# Altium schematic sheet Power Isolation.SchDoc: Power Isolation
size 431 x 279 mm; Engineer: Harsha Sandirigama; Revision: -; SheetNumber: 2; SheetTotal: 3; Project: USB Isolator; ENG_APP_DATE: --/--/--; DSN_APP_DATE: --/--/--; CHK_APP_DATE: --/--/--
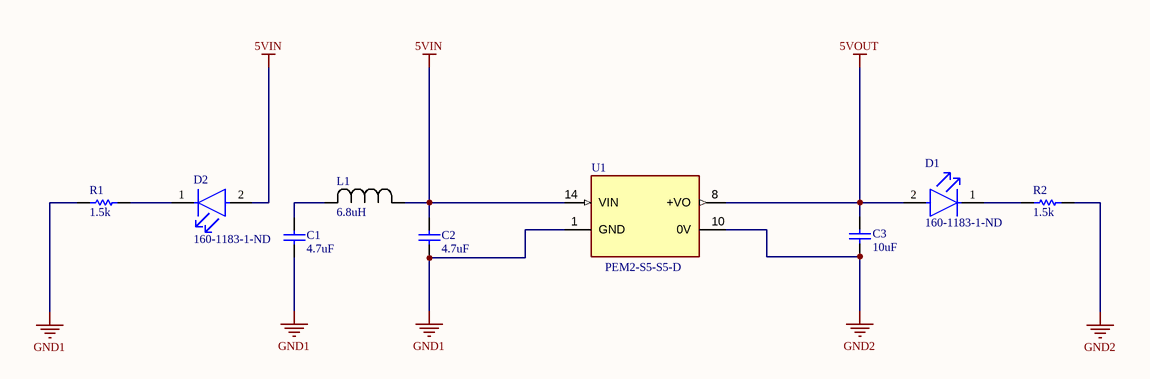
[diagram p0: Power Isolation.SchDoc]

## Parts
C1  4.7uF  [1206C]
C2  4.7uF  [1206C]
C3  10uF  [1206C]
D1  Supplier Part Number 1: 160-1183-1-ND  [Lite-On_0_MFG]  (hidden comment: LED)
D2  Supplier Part Number 1: 160-1183-1-ND  [Lite-On_0_MFG]  (hidden comment: LED)
L1  6.8uH  [IND_TAIYO_LBC3225_TAY]
R1  1.5k  [0805R]
R2  1.5k  [0805R]
U1  PEM2-S5-S5-D  [CONV_PEM2-S5-S5-D]

## Nets
5VIN: C2.2 D2.2(A) L1.1 U1.14(VIN)
5VOUT: C3.2 D1.2(A) U1.8(+VO)
GND1: C1.1 C2.1 R1.1 U1.1(GND)
GND2: C3.1 R2.2 U1.10(0V)
NetC1_2: C1.2 L1.2
NetD1_1: D1.1(C) R2.1
NetD2_1: D2.1(C) R1.2

## Notes on the sheet
- DWG. NO.
- REV.
- SHT.
- THIS DOCUMENT AND THE DATA DISCLOSED HEREIN OR HEREWITH IS THE PROPERTY OF ALTIUM LIMITED AND MAY BE FREELY DISTRIBUTED IN WHOLE. NO RIGHTS ARE RESERVED OR EXPRESS OR IMPLIED WARANTEE GIVEN.
- REVISION
- DESCRIPTION
- DATE
- APPROVED
- ENG:
- APPROVALS
- PROJECT
- DSN:
- CHK:
- REFERENCE DOCUMENTS
- PROJECT REVISION:
- TITLE
- DOCUMENT REVISION:
- DESIGN ITEM:
- BOM:
- FAB DWG:
- PCB DWG:
- ASSY DWG:
- SCALE:
- SIZE
- B
- CAGE CODE
- FILE NAME
- DWG NO.
- SHEET
- OF
- REV

## Library data of the parts
C1 C2 = GRM31CR71H475KA12L: CAP CER 4.7UF 50V X7R 1206; Manufacturer: Murata; Material: Ceramic; Tolerance: 10%; Supplier 1: Digi-Key; Manufacturer Part Number: GRM31CR71H475KA12L; RoHS: Yes; Category: Ceramic Capacitors; Stock 1: 866926; Pricing 1: 1=0.44000, 10=0.30200, 50=0.21180, 100=0.18150, 500=0.13612, 1000=0.11495 (USD); Mount: Surface Mount; Case/Package: 1206; Case Code (Metric): 3216; Case Code (Imperial): 1206; Min Operating Temperature: -55°C; Max Operating Temperature: 125°C; Capacitance: 4.7uF; Packaging: Tape and Reel; Voltage Rating (DC): 50V; Package Quantity: 2000; Voltage Rating: 50V; Dielectric: X7R; Voltage: 50V; Termination: SMD/SMT; Series: GRM; Construction: Flat; Length: 3.2mm; Width: 0.063inch; Height: 1.6mm; Depth: 1.6mm; Thickness: 0.071inch; Radiation Hardening: No; REACH SVHC: No SVHC; Lead Free: Lead Free; RoHS Compliant: Yes; ComponentLink1URL: https://datasheet.ciiva.com/6072/415379-6072784.pdf?src-supplier=Farnell; ComponentLink1Description: https://datasheet.ciiva.com/6072/415379-6072784.pdf?src-supplier=Farnell; ComponentLink2URL: https://datasheet.ciiva.com/3777/2267grm31cr71h475ka1223-3777241.pdf?src-supplier=Arrow+Electronics; ComponentLink2Description: https://datasheet.ciiva.com/3777/2267grm31cr71h475ka1223-3777241.pdf?src-supplier=Arrow+Electronics; ComponentLink3URL: https://datasheet.ciiva.com/29202/450972-da-01-de-vs-chip-kond-1206-4-7-uf-10pr-50-0v-x7r-29202576.pdf?src-supplier=Conrad; ComponentLink3Description: https://datasheet.ciiva.com/29202/450972-da-01-de-vs-chip-kond-1206-4-7-uf-10pr-50-0v-x7r-29202576.pdf?src-supplier=Conrad; ComponentLink4URL: https://datasheet.ciiva.com/29202/451279-da-01-de-vs-kondens-grm31-cr71h-475ka12l-29202365.pdf?src-supplier=Conrad; ComponentLink4Description: https://datasheet.ciiva.com/29202/451279-da-01-de-vs-kondens-grm31-cr71h-475ka12l-29202365.pdf?src-supplier=Conrad; ComponentLink5URL: https://datasheet.ciiva.com/7937/415310-7937749.pdf?src-supplier=Element14; ComponentLink5Description: https://datasheet.ciiva.com/7937/415310-7937749.pdf?src-supplier=Element14; ComponentLink6URL: https://datasheet.ciiva.com/6270/partnumbering-e-01-6270218.pdf?src-supplier=Digi-Key; ComponentLink6Description: https://datasheet.ciiva.com/6270/partnumbering-e-01-6270218.pdf?src-supplier=Digi-Key; ComponentLink7URL: https://datasheet.ciiva.com/6270/partnumbering-e-01-6270217.pdf?src-supplier=Digi-Key; ComponentLink7Description: https://datasheet.ciiva.com/6270/partnumbering-e-01-6270217.pdf?src-supplier=Digi-Key; ComponentLink8URL: https://datasheet.ciiva.com/6270/partnumbering-e-01-6270219.pdf?src-supplier=Digi-Key; ComponentLink8Description: https://datasheet.ciiva.com/6270/partnumbering-e-01-6270219.pdf?src-supplier=Digi-Key; Supplier Part Number 1: 490-6521-1-ND
C3 = TMK316BJ106ML-T: Capacitor 10uF ±20% 25V 1206; Manufacturer: Taiyo Yuden; Tolerance: 10%; Dielectric: X5R; Supplier 1: Digi-Key; Manufacturer Part Number: TMK316BJ106ML-T; RoHS: Yes; Category: Ceramic Capacitors; Stock 1: 411339; Pricing 1: 1=0.28000, 10=0.18900, 50=0.12600, 100=0.10710, 500=0.07562, 1000=0.06617 (USD); Mount: Surface Mount; Case/Package: 1206; Number of Pins: 2; Case Code (Imperial): 1206; Case Code (Metric): 3216; Contact Plating: Nickel; Min Operating Temperature: -55°C; Max Operating Temperature: 85°C; Capacitance: 10uF; Packaging: Tape and Reel; Voltage Rating: 25V; Package Quantity: 1; Voltage Rating (DC): 25V; Termination: SMD/SMT; Voltage: 25V; Series: M; Construction: Flat; Resistor Type: Ceramic; Length: 3.2mm; Width: 1.6mm; Height: 1.6mm; Depth: 1.6mm; Thickness: 0.071inch; Radiation Hardening: No; REACH SVHC: Unknown; RoHS Compliant: Yes; Lead Free: Lead Free; Halogen Free: Halogen Free; ComponentLink1URL: https://datasheet.ciiva.com/137/tmk316bj106ml-t-ss-137881.pdf?src-supplier=Digi-Key; ComponentLink1Description: https://datasheet.ciiva.com/137/tmk316bj106ml-t-ss-137881.pdf?src-supplier=Digi-Key; ComponentLink2URL: https://datasheet.ciiva.com/11601/tmk316bj106ml-t-ss-11601883.pdf?src-supplier=Avnet; ComponentLink2Description: https://datasheet.ciiva.com/11601/tmk316bj106ml-t-ss-11601883.pdf?src-supplier=Avnet; ComponentLink3URL: https://datasheet.ciiva.com/15922/1117tmk316bj106ml-t-15922416.pdf?src-supplier=Onlinecomponents.com; ComponentLink3Description: https://datasheet.ciiva.com/15922/1117tmk316bj106ml-t-15922416.pdf?src-supplier=Onlinecomponents.com; ComponentLink4URL: https://datasheet.ciiva.com/30087/617tmk316bj106ml-t-30087946.pdf?src-supplier=Onlinecomponents.com; ComponentLink4Description: https://datasheet.ciiva.com/30087/617tmk316bj106ml-t-30087946.pdf?src-supplier=Onlinecomponents.com; ComponentLink5URL: https://datasheet.ciiva.com/7975/1481447-7975845.pdf?src-supplier=Element14; ComponentLink5Description: https://datasheet.ciiva.com/7975/1481447-7975845.pdf?src-supplier=Element14; ComponentLink6URL: https://datasheet.ciiva.com/7975/1481447-7975597.pdf?src-supplier=Element14; ComponentLink6Description: https://datasheet.ciiva.com/7975/1481447-7975597.pdf?src-supplier=Element14; ComponentLink7URL: https://datasheet.ciiva.com/28645/746258-28645286.pdf?src-supplier=Element14; ComponentLink7Description: https://datasheet.ciiva.com/28645/746258-28645286.pdf?src-supplier=Element14
D1 D2 = LTST-C190GKT: LED 0603(H=0.9mm) λD=569nm VR=5V VF=2.1V~2.6V IF=20mA PD=100mW; Manufacturer: Vishay Lite-On; Color: Green; Lens Color: Colorless; Luminous Intensity: 6mcd; Forward Voltage: 2.1V; Viewing Angle: 130°; Lens Style: Clear,Diffused,Colorless,Rectangular; Forward Current: 30mA; Dominant Wavelength: 569nm; Test Current: 10mA; Number of Elements: 1; Power Dissipation: 100mW; Wavelength: 565nm; Reverse Voltage: 5V; Lens Transparency: Clear; Voltage: 2V; Supplier 1: Digi-Key; Manufacturer Part Number: LTST-C190GKT; RoHS: Yes; Category: LEDs; Stock 1: 553647; Pricing 1: 1=0.24000, 10=0.13200, 100=0.06110, 500=0.05640, 1000=0.04418, 2000=0.04324 (USD); Mount: Surface Mount; Case/Package: 0603; Number of Pins: 2; Case Code (Metric): 1608; Case Code (Imperial): 0603; Min Operating Temperature: -55°C; Max Operating Temperature: 85°C; Package Quantity: 1; Packaging: Tape and Reel; Illumination Color: Green; Number of LEDs: 1; Power Rating: 100mW; Length: 1.6mm; Width: 0.8mm; Height: 0.8mm; Depth: 0.8mm; Radiation Hardening: No; RoHS Compliant: Yes; Lead Free: Lead Free; ComponentLink1URL: https://datasheet.ciiva.com/2109/ltst-c190gkt-2109985.pdf?src-supplier=Digi-Key; ComponentLink1Description: https://datasheet.ciiva.com/2109/ltst-c190gkt-2109985.pdf?src-supplier=Digi-Key; ComponentLink2URL: https://datasheet.ciiva.com/11775/0900766b80dc02a6-11775616.pdf?src-supplier=RSComponents; ComponentLink2Description: https://datasheet.ciiva.com/11775/0900766b80dc02a6-11775616.pdf?src-supplier=RSComponents; ComponentLink3URL: https://datasheet.ciiva.com/12403/lite-on-ltst-c190gkt-187204-12403884.pdf?src-supplier=Mouser; ComponentLink3Description: https://datasheet.ciiva.com/12403/lite-on-ltst-c190gkt-187204-12403884.pdf?src-supplier=Mouser; ComponentLink4URL: https://datasheet.ciiva.com/16392/lite-on20ltst-c190gkt-16392818.pdf?src-supplier=Future+Electronics; ComponentLink4Description: https://datasheet.ciiva.com/16392/lite-on20ltst-c190gkt-16392818.pdf?src-supplier=Future+Electronics; ComponentLink5URL: https://datasheet.ciiva.com/2109/ltst-c190gkt-2109986.pdf?src-supplier=Digi-Key; ComponentLink5Description: https://datasheet.ciiva.com/2109/ltst-c190gkt-2109986.pdf?src-supplier=Digi-Key; ComponentLink6URL: https://datasheet.ciiva.com/2109/ltst-c190gkt-2109987.pdf?src-supplier=Digi-Key; ComponentLink6Description: https://datasheet.ciiva.com/2109/ltst-c190gkt-2109987.pdf?src-supplier=Digi-Key
L1 = LBC3225T6R8MR_1: Inductor General Purpose Chip Wirewound 6.8uH 20% 100KHz Ferrite 0.62A 0.156Ohm DCR 1210 T/R; Mfr_Name: Taiyo Yuden; Type: DEV; Self Resonant Frequency: 50MHz; Current Rating: 620mA; Shielding: Unshielded; DC Resistance (DCR): 120mR; Copyright: Copyright (C) 2022 Ultra Librarian. All rights reserved.; Manufacturer_Part_Number: LBC3225T6R8MR; RefDes: RefDes; Supplier 1: Digi-Key; Manufacturer: Taiyo Yuden; Manufacturer Part Number: LBC3225T6R8MR; RoHS: Yes; Category: Fixed Inductors; Stock 1: 24416; Pricing 1: 1=0.20000, 10=0.17800, 25=0.15840, 50=0.13460, 100=0.11880, 250=0.10888, 500=0.09900 (USD); Mount: Surface Mount; Case/Package: 1210; Number of Pins: 2; Core Material: Ferrite; Case Code (Metric): 3225; Case Code (Imperial): 1210; Min Operating Temperature: -40°C; Max Operating Temperature: 105°C; Packaging: Tape and Reel; Package Quantity: 1000; Inductance: 6.8uH; Test Frequency: 100kHz; Series: LB; Tolerance: 20%; Max DC Current: 620mA; Termination: SMD/SMT; Resistor Type: Wirewound; Inductance Tolerance: 20%; Length: 0.126inch; Width: 2.5mm; Height: 2.5mm; Height - Seated (Max): 0.106inch; Depth: 2.7mm; Lead Pitch: 2.7mm; Radiation Hardening: No; REACH SVHC: Unknown; Lead Free: Lead Free; Halogen Free: Halogen Free; ComponentLink1URL: https://datasheet.ciiva.com/8503/lbc3225t6r8mr-ss-8503074.pdf?src-supplier=Avnet; ComponentLink1Description: https://datasheet.ciiva.com/8503/lbc3225t6r8mr-ss-8503074.pdf?src-supplier=Avnet; Supplier Part Number 1: 587-2433-1-ND
R1 R2 = CRCW08051K50FKEA: Res Thick Film 0805 1.5K Ohm 1% 1/8W ±100ppm/°C Molded SMD Paper T/R; Manufacturer: Vishay; Voltage Rating: 150V; Resistance: 1.5kR; Power Rating: 125mW; Supplier 1: RSComponents; Manufacturer Part Number: CRCW08051K50FKEA; RoHS: Yes; Category: Chip SMD Resistors; Stock 1: 1; Pricing 1: 50=0.09800, 500=0.09100, 1000=0.08200, 2000=0.07300, 4000=0.06500 (USD); Case/Package: 0805; Case Code (Metric): 2012; Case Code (Imperial): 0805; Contact Plating: Tin; Weight: 0.000194oz; Size Code: 0805; Min Operating Temperature: -55°C; Max Operating Temperature: 155°C; Package Quantity: 10; Series: CRCW; Packaging: Tape and Reel; Termination: SMD/SMT; Temperature Coefficient: 100ppm/°C; Voltage Rating (DC): 150V; Construction: Rectangular; Tolerance: 1%; Resistor Type: Thick Film; Number of Terminations: 2; Max Power Dissipation: 125mW; Features: Automotive AEC-Q200; Resistance Tolerance: 1%; Technology: THICK FILM; Length: 2mm; Width: 0.049inch; Height: 0.45mm; Depth: 1.25mm; Radiation Hardening: No; RoHS Compliant: Yes; REACH SVHC: Unknown; Lead Free: Lead Free; Military Standard: Not; ComponentLink1URL: https://datasheet.ciiva.com/11809/0900766b80d98b26-11809039.pdf?src-supplier=RSComponents; ComponentLink1Description: https://datasheet.ciiva.com/11809/0900766b80d98b26-11809039.pdf?src-supplier=RSComponents; ComponentLink2URL: https://datasheet.ciiva.com/2467/dcrcwe3-2467186.pdf?src-supplier=Digi-Key; ComponentLink2Description: https://datasheet.ciiva.com/2467/dcrcwe3-2467186.pdf?src-supplier=Digi-Key; ComponentLink3URL: https://datasheet.ciiva.com/3258/dcrcwe3-3258255.pdf?src-supplier=Avnet; ComponentLink3Description: https://datasheet.ciiva.com/3258/dcrcwe3-3258255.pdf?src-supplier=Avnet; ComponentLink4URL: https://datasheet.ciiva.com/2467/dcrcwe3-2467185.pdf?src-supplier=Digi-Key; ComponentLink4Description: https://datasheet.ciiva.com/2467/dcrcwe3-2467185.pdf?src-supplier=Digi-Key; ComponentLink5URL: https://datasheet.ciiva.com/2467/dcrcwe3-2467187.pdf?src-supplier=Digi-Key; ComponentLink5Description: https://datasheet.ciiva.com/2467/dcrcwe3-2467187.pdf?src-supplier=Digi-Key; ComponentLink6URL: https://datasheet.ciiva.com/16291/dcrcwe3-16291272.pdf?src-supplier=Future+Electronics; ComponentLink6Description: https://datasheet.ciiva.com/16291/dcrcwe3-16291272.pdf?src-supplier=Future+Electronics; ComponentLink7URL: https://datasheet.ciiva.com/7777/1697337-7777375.pdf?src-supplier=Element14; ComponentLink7Description: https://datasheet.ciiva.com/7777/1697337-7777375.pdf?src-supplier=Element14; ComponentLink8URL: https://datasheet.ciiva.com/7777/1720486-7777609.pdf?src-supplier=Element14; ComponentLink8Description: https://datasheet.ciiva.com/7777/1720486-7777609.pdf?src-supplier=Element14; ComponentLink9URL: https://datasheet.ciiva.com/16778/70201119-16778857.pdf?src-supplier=Allied+Electronics; ComponentLink9Description: https://datasheet.ciiva.com/16778/70201119-16778857.pdf?src-supplier=Allied+Electronics; ComponentLink10URL: https://datasheet.ciiva.com/26312/fld-crcw-e3-data-en-26312926.pdf?src-supplier=Distrelec; ComponentLink10Description: https://datasheet.ciiva.com/26312/fld-crcw-e3-data-en-26312926.pdf?src-supplier=Distrelec; Supplier Part Number 1: 6791014; Supplier 2: Digi-Key; Pricing 2: 1=0.10000, 10=0.06700, 100=0.02710, 1000=0.01219, 2500=0.01058 (USD); Supplier Part Number 2: 541-1.50KCDKR-ND
U1 = PEM2-S5-S5-D: 2 W, 5 V, 400 mA, Single Unregulated Output, Isolated Dc-Dc converter; Manufacturer: CUI; Number of Outputs: 1; Efficiency: 85%; Min Input Voltage: 4.5V; Max Input Voltage: 5.5V; Voltage - Output 1: 5V; Max Output Current: 400mA; Isolation Voltage: 3kV; Max Power Dissipation: 2W; Package: None; Price: None; Value: *; Availability: Unavailable; Supplier 1: Digi-Key; Manufacturer Part Number: PEM2-S5-S5-D; RoHS: Yes; Category: Voltage Regulators - Switching; Stock 1: 242; Pricing 1: 1=8.33000, 5=8.21200, 10=8.09200, 25=7.85400, 50=7.61600, 100=7.37800, 250=7.14000, 450=6.66400 (USD); Mount: Through Hole; Case/Package: DIP; Weight: 0.084658oz; Min Operating Temperature: -40°C; Max Operating Temperature: 105°C; Package Quantity: 25; Packaging: Bulk; Output Power: 2W; Current - Output 1: 400mA; Features: SCP; Length: 20mm; Width: 10mm; Height: 0.32inch; Lead Free: Lead Free; ComponentLink1URL: http://www.mouser.com/ds/2/670/pem2-d-1079633.pdf?src-supplier=Mouser; ComponentLink1Description: http://www.mouser.com/ds/2/670/pem2-d-1079633.pdf?src-supplier=Mouser; ComponentLink2URL: https://www.cui.com/product/resource/digikeypdf/pem2-d.pdf?src-supplier=Digi-Key; ComponentLink2Description: https://www.cui.com/product/resource/digikeypdf/pem2-d.pdf?src-supplier=Digi-Key; ComponentLink3URL: http://www.cui.com/product/resource/digikeypdf/pem2-d.pdf?src-supplier=Digi-Key; ComponentLink3Description: http://www.cui.com/product/resource/digikeypdf/pem2-d.pdf?src-supplier=Digi-Key; Supplier Part Number 1: 102-4560-ND; RoHS Compliant: Yes; MP: PEM2-S5-S5-D